# Altium project WeatherWidget.PrjPcb
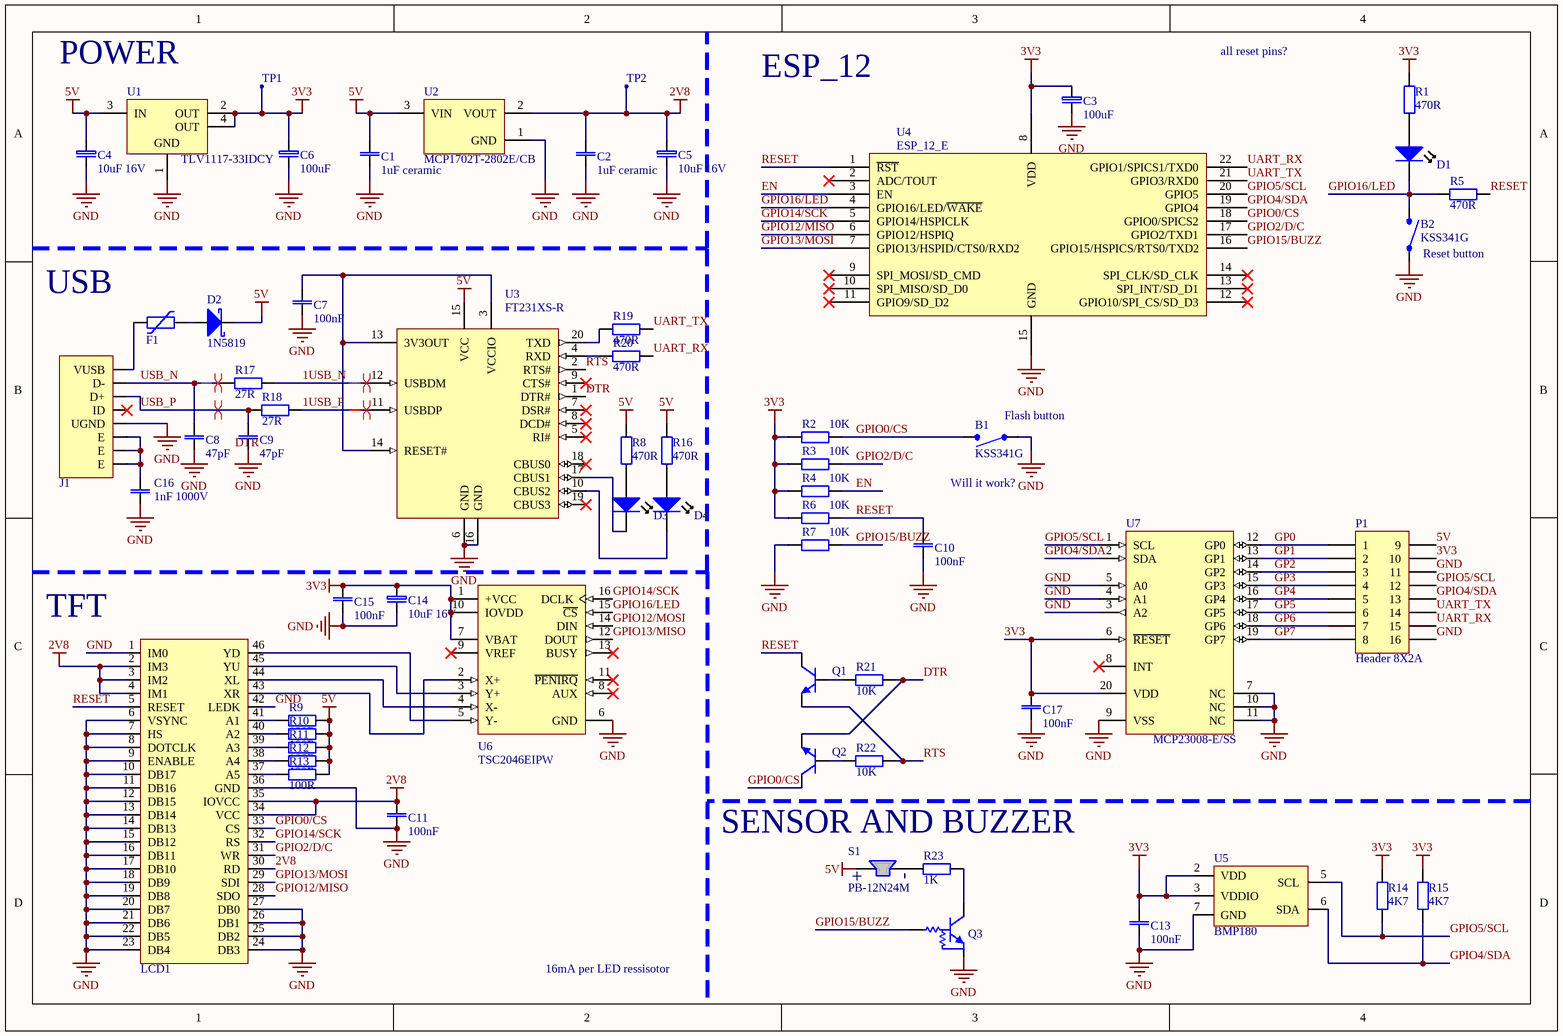
[diagram p0: WeatherStation_V2.SchDoc]
1 sheet, 62 parts. Net scope: global (net labels, ports and power ports of the same name join across sheets).
Board file: WeathcerStation_V2.PcbDoc

## Sheet WeatherStation_V2.SchDoc
size A4

### Parts
B1  KSS341G  [KSS341G]
B2  KSS341G  [KSS341G]
C1  1uF ceramic  [C0603]
C2  1uF ceramic  [C0603]
C3  100uF  [CASE B]
C4  10uF 16V  [Case A]
C5  10uF 16V  [Case A]
C6  100uF  [CASE B]
C7  100nF  [C0603]
C8  47pF  [C0603]
C9  47pF  [C0603]
C10  100nF  [C0603]
C11  100nF  [C0603]
C13  100nF  [C0603]
C14  10uF 16V  [Case A]
C15  100nF  [C0603]
C16  1nF 1000V  [C1206]
C17  100nF  [C0603]
D1  BLUE LED  [LED0805B]  (value not drawn)
D2  1N5819  [1N5819-SMA]
D3  GREEN LED  [LED0805G]  (value not drawn)
D4  GREEN LED  [LED0805G]  (value not drawn)
F1  MF-MSMF075-2  [F1812]  (value not drawn)
J1  USB B MICRO R/A SMD 1  [USB B MICRO R/A SMD 1]  (value not drawn)
LCD1  KWH032ST05-F02  [KWH032ST05-F02]  (value not drawn)
P1  Header 8X2A  [HDR2X8_CEN]
Q1  BC817  [SOT23]  (value not drawn)
Q2  BC817  [SOT23]  (value not drawn)
Q3  PDTC123JT  [SOT23]  (value not drawn)
R1  470R  [R0603]
R2  10K  [R0603]
R3  10K  [R0603]
R4  10K  [R0603]
R5  470R  [R0603]
R6  10K  [R0603]
R7  10K  [R0603]
R8  470R  [R0603]
R9  100R  [R0603]
R10  100R  [R0603]
R11  100R  [R0603]
R12  100R  [R0603]
R13  100R  [R0603]
R14  4K7  [R0603]
R15  4K7  [R0603]
R16  470R  [R0603]
R17  27R  [R0603]
R18  27R  [R0603]
R19  470R  [R0603]
R20  470R  [R0603]
R21  10K  [R0603]
R22  10K  [R0603]
R23  1K  [R0603]
S1  PB-12N24M  [PB-12N24M]
TP1  TestPoint_1.5mm  [TP_1.5mm]  (value not drawn)
TP2  TestPoint_1.5mm  [TP_1.5mm]  (value not drawn)
U1  TLV1117-33IDCY  [TI-DCY4_N]
U2  MCP1702T-2802E/CB  [SOT-23A-CB3_N]
U3  FT231XS-R  [SSOP-20_N]
U4  ESP_12_E  [ESP-12Q/F]
U5  BMP180  [BMP180]
U6  TSC2046EIPW  [PW016]
U7  MCP23008-E/SS  [SSOP-SS20_N]

### Nets
2V8: C2.2 C5.1 C11.2 LCD1.2(IM3) LCD1.3(IM2) LCD1.4(IM1) LCD1.30(RD) LCD1.34(VCC) LCD1.35(IOVCC) TP2.1 U2.2(VOUT)
3V3: C3.1 C6.1 C13.2 C14.1 C15.2 C17.2 P1.10 R1.1 R2.1 R3.1 R4.1 R6.1 R14.2 R15.2 TP1.1 U1.2(OUT) U1.4(OUT) U4.8(VDD) U5.2(VDD) U5.3(VDDIO) U6.1(+VCC) U6.7(VBAT) U6.10(IOVDD) U7.6(~{RESET}) U7.20(VDD)
5V: C1.2 C4.1 D2.1 P1.9 R8.2 R9.2 R10.2 R11.2 R12.2 R13.2 R16.2 S1.1(+) U1.3(IN) U2.3(VIN) U3.15(VCC)
GND: B1.1 B2.1 C1.1 C2.1 C3.2 C4.2 C5.2 C6.2 C7.1 C8.1 C9.1 C10.1 C11.1 C13.1 C14.2 C15.1 C16.1 C17.1 J1.5(UGND) LCD1.1(IM0) LCD1.6(VSYNC) LCD1.7(HS) LCD1.8(DOTCLK) LCD1.9(ENABLE) LCD1.10(DB17) LCD1.11(DB16) LCD1.12(DB15) LCD1.13(DB14) LCD1.14(DB13) LCD1.15(DB12) LCD1.16(DB11) LCD1.17(DB10) LCD1.18(DB9) LCD1.19(DB8) LCD1.20(DB7) LCD1.21(DB6) LCD1.22(DB5) LCD1.23(DB4) LCD1.24(DB3) LCD1.25(DB2) LCD1.26(DB1) LCD1.27(DB0) LCD1.36(GND) LCD1.42(LEDK) P1.11 P1.16 Q3.2 R7.1 U1.1(GND) U2.1(GND) U3.6(GND) U3.16(GND) U4.15(GND) U5.7(GND) U6.6(GND) U7.3(A2) U7.4(A1) U7.5(A0) U7.7(NC) U7.9(VSS) U7.10(NC) U7.11(NC)
1USB_N: R17.2 U3.12(USBDM)
1USB_P: R18.2 U3.11(USBDP)
DTR: Q2.2 R21.2 U3.1(DTR#)
EN: R4.2 U4.3(EN)
GP0: P1.1 U7.12(GP0)
GP1: P1.2 U7.13(GP1)
GP2: P1.3 U7.14(GP2)
GP3: P1.4 U7.15(GP3)
GP4: P1.5 U7.16(GP4)
GP5: P1.6 U7.17(GP5)
GP6: P1.7 U7.18(GP6)
GP7: P1.8 U7.19(GP7)
GPIO0/CS: B1.2 LCD1.33(CS) Q2.3 R2.2 U4.18(GPIO0/SPICS2)
GPIO2/D/C: LCD1.31(WR) R3.2 U4.17(GPIO2/TXD1)
GPIO4/SDA: P1.13 R15.1 U4.19(GPIO4) U5.6(SDA) U7.2(SDA)
GPIO5/SCL: P1.12 R14.1 U4.20(GPIO5) U5.5(SCL) U7.1(SCL)
GPIO12/MISO: LCD1.28(SDO) U4.6(GPIO12/HSPIQ)
GPIO12/MOSI: U6.14(DIN)
GPIO13/MISO: U6.12(DOUT)
GPIO13/MOSI: LCD1.29(SDI) U4.7(GPIO13/HSPID/CTS0/RXD2)
GPIO14/SCK: LCD1.32(RS) U4.5(GPIO14/HSPICLK) U6.16(DCLK)
GPIO15/BUZZ: Q3.1 R7.2 U4.16(GPIO15/HSPICS/RTS0/TXD2)
GPIO16/LED: B2.2 D1.1 R5.1 U4.4(GPIO16/LED/~{WAKE}) U6.15(~{CS})
RESET: C10.2 LCD1.5(RESET) Q1.3 R5.2 R6.2 U4.1(~{RST})
RTS: Q1.2 R22.2 U3.2(RTS#)
UART_RX: P1.15 R20.2 U4.22(GPIO1/SPICS1/TXD0)
UART_TX: P1.14 R19.2 U4.21(GPIO3/RXD0)
USB_N: C8.2 J1.2(D-) R17.1
USB_P: C9.2 J1.3(D+) R18.1
NetC7_2: C7.2 U3.3(VCCIO) U3.13(3V3OUT) U3.14(RESET#)
NetC16_2: C16.2 J1.6(E) J1.7(E) J1.8(E)
NetD1_2: D1.2 R1.2
NetD2_2: D2.2 F1.2
NetD3_1: D3.1 U3.17(CBUS1)
NetD3_2: D3.2 R8.1
NetD4_1: D4.1 U3.10(CBUS2)
NetD4_2: D4.2 R16.1
NetF1_1: F1.1 J1.1(VUSB)
NetLCD1_37: LCD1.37(A5) R13.1
NetLCD1_38: LCD1.38(A4) R12.1
NetLCD1_39: LCD1.39(A3) R11.1
NetLCD1_40: LCD1.40(A2) R10.1
NetLCD1_41: LCD1.41(A1) R9.1
NetLCD1_43: LCD1.43(XR) U6.2(X+)
NetLCD1_44: LCD1.44(XL) U6.4(X-)
NetLCD1_45: LCD1.45(YU) U6.3(Y+)
NetLCD1_46: LCD1.46(YD) U6.5(Y-)
NetQ1_1: Q1.1 R21.1
NetQ2_1: Q2.1 R22.1
NetQ3_3: Q3.3 R23.2
NetR19_1: R19.1 U3.20(TXD)
NetR20_1: R20.1 U3.4(RXD)
NetR23_1: R23.1 S1.2(-)

Not connected (* = marked no-connect by the designer): J1 4(ID)*; U3 5(RI#)* 7(DSR#)* 8(DCD#)* 9(CTS#)* 18(CBUS0)* 19(CBUS3)*; U4 2(ADC/TOUT)* 9(SPI_MOSI/SD_CMD)* 10(SPI_MISO/SD_D0)* 11(GPIO9/SD_D2)* 12(GPIO10/SPI_CS/SD_D3)* 13(SPI_INT/SD_D1)* 14(SPI_CLK/SD_CLK)*; U6 8(AUX)* 9(VREF)* 11(~{PENIRQ})* 13(BUSY)*; U7 8(INT)*

### Layout directives
differential pair: 1USB_N, 1USB_P, USB_N, USB_P

### Notes on the sheet
- (near U1) POWER
- ESP_12
- all reset pins?
- USB
- (near B2) Reset button
- (near B1) Flash button
- Will it work?
- (near LCD1) TFT
- SENSOR AND BUZZER
- 16mA per LED ressisotor
- Labels drawn without touching a wire or pin: DTR

### Library data of the parts
B1 B2 = KSS341G: side-mounted tactile button
C1 C2 C7-C11 C13 C15 C17 = C0603: SMD Capacitor
C3 C6 = Case B: Tantalum capacitor
C4 C5 C14 = Case A: Tantalum capacitor
C16 = C1206: SMD Capacitor
D1 = LED0805B: BLUE SMD LED 0805
D2 = 1N5819(SS14): 40V 1A UFM0.5V/1A IFM30A IR0.4mA, Schottky
D3 D4 = LED0805G: GREEN SMD LED 0805
F1 = PFMF.XXX.X: Resettable Fuse 1812
P1 = Header 8X2A: Header, 8-Pin, Dual row; LatestRevisionDate: 17-Jul-2002; LatestRevisionNote: Re-released for DXP Platform.; Publisher: Altium Limited
Q1 Q2 = BC817: NPN SOT23
Q3 = PDTC123JT: DIGI TRANS Rin 2.2k Rbe 47k NPN 50V 100mA
R1-R23 = R0603: SMD Resistor
TP1 TP2 = TestPoint_1.5mm: TestPoint SMD pad 1.5mm
U1 = TLV1117LV33DCYR: Single Output LDO, 1 A, Fixed 3.3 V Output, 2 to 5.5 V Input, 4-pin SOT-223 (DCY), -40 to 125 degC, Green (RoHS & no Sb/Br); Manufacturer: Texas Instruments; Accuracy(%): 2; Fixed Output Options(V): 3.3; Iout(Max)(A): 1; Iq(Typ)(mA): 0.05; SubFamily: Single Channel LDO; Vdo(Typ)(mV): 1200; Vin(Max)(V): 5.5; DatasheetVersion: SBVS160A; PackageVersion: 4202506/B; PackageReference: DCY4; PackageDescription: 4-Pin Plastic Small Outline, Body 3.5 x 6.5 mm, Pitch 2.3 mm; Supplier 1: Digi-Key; Supplier Part Number 1: 296-28778-2-ND; Supplier 2: Digi-Key; Supplier Part Number 2: 296-28778-1-ND; Supplier 3: Digi-Key; Supplier Part Number 3: 296-28778-6-ND; Supplier 4: Newark; Supplier Part Number 4: 48T4644; Supplier 5: Mouser; Supplier Part Number 5: 595-TLV1117LV33DCYR; Eco-Plan: Green (RoHS & no Sb/Br); Vin(Min)(V): 2; Vout Adj(Max)(V): 3.3; Vout Adj(Min)(V): 3.3; Mounting Technology: Surface Mount; Code_JEDEC: TO-261; PartNumber: TLV1117LV33DCYR; ComponentLink1Description: Manufacturer URL; ComponentLink1URL: http://www.ti.com/; ComponentLink2Description: Datasheet; ComponentLink2URL: http://www.ti.com/general/docs/lit/getliterature.tsp?genericPartNumber=TLV1117LV33&fileType=pdf; ComponentLink3Description: Package Specification; ComponentLink3URL: http://www.ti.com/litv/pdf/mpds094a
U2 = MCP1702T-2802E/CB: 250 mA Low Quiescent Current LDO Regulator, 3-Pin SOT-23A, Extended Temperature, Tape and Reel; Manufacturer: Microchip; DatasheetVersion: revD, Jun-2009; PackageVersion: revBB, Aug-2009; PackageReference: SOT-23A-CB3; PackageDescription: 3-Lead Plastic Small Outline Transistor (CB) [SOT-23A]; Supplier 1: Digi-Key; Supplier Part Number 1: MCP1702T-2802E/CBTR-ND; Supplier 2: Digi-Key; Supplier Part Number 2: MCP1702T-2802E/CBCT-ND; Supplier 3: Digi-Key; Supplier Part Number 3: MCP1702T-2802E/CBDKR-ND; Supplier 4: Mouser; Supplier Part Number 4: 579-MCP1702T2802E/CB; Mounting Technology: Surface Mount; PartNumber: MCP1702T-2802E/CB; ComponentLink1Description: Manufacturer URL; ComponentLink1URL: http://www.microchip.com/; ComponentLink2Description: Datasheet; ComponentLink2URL: http://ww1.microchip.com/downloads/en/DeviceDoc/22008d.pdf; ComponentLink3Description: Package Specification; ComponentLink3URL: http://www.microchip.com/stellent/groups/techpub_sg/documents/packagingspec/en012702.pdf
U3 = FT231XS-R: USB to Full-Handshake UART Interface Chip, UHCI/OHCI/EHCI Compatible, USB 2.0 Compatible, -40 to +85 degC, 20-Pin SSOP, Pb-Free, Tape and Reel; Manufacturer: FTDI; DatasheetVersion: ver 1.2, Feb-2013; PackageVersion: Feb-13; PackageReference: SSOP-20; PackageDescription: 20-Pin Small Outline Package, 8.6 x 3.9 mm Body, 0.635 mm Pitch; Code_JEDEC: MO-137-AD; PartNumber: FT231XS-R; ComponentLink1Description: Manufacturer URL; ComponentLink1URL: http://www.ftdichip.com/; ComponentLink2Description: Datasheet; ComponentLink2URL: http://www.ftdichip.com/Support/Documents/DataSheets/ICs/DS_FT231X.pdf; ComponentLink3Description: FT231X Product Page; ComponentLink3URL: www.ftdichip.com/Products/ICs/FT231X.html
U4 = ESP_12_E: ESP-12 Wi-Fi Module by AI-Thinker; IC: ESP8266-EX; Vendor: Ai-thinker
U5 = BMP180: temperature/pressure/altitude sensor
U6 = TSC2046EIPW: 4-Wire Touch Screen controller with Low-Voltage I/O Interface, 16-Pin TSSOP; Published: 6-Oct-2005; DatasheetVersion: Jan-2005; PackageVersion: Feb-1999; PackageReference: PW016; Publisher: Altium Limited; PackageDescription: Shrink Small Outline; 16 Leads; Body Width 4.4 mm; Pitch 0.65 mm; ComponentLink1Description: Manufacturer Link; ComponentLink1URL: http://focus.ti.com/docs/prod/folders/print/tsc2046.html; ComponentLink2Description: Datasheet; ComponentLink2URL: http://focus.ti.com/lit/ds/symlink/tcs2046.pdf
U7 = MCP23008-E/SS: 8-Bit I/O Expander with Serial Interface, 20-Pin SSOP, Extended Temperature; Manufacturer: Microchip; DatasheetVersion: revE, Aug-2007; PackageVersion: revBB, Aug-2009; PackageReference: SSOP-SS20; PackageDescription: 20-Lead Plastic Shrink Small Outline (SS) - 5.3mm Body [SSOP]; Supplier 1: Digi-Key; Supplier Part Number 1: MCP23008-E/SS-ND; Supplier 2: Farnell; Supplier Part Number 2: 1605564; Supplier 3: Newark; Supplier Part Number 3: 08J8739; Supplier 4: Mouser; Supplier Part Number 4: 579-MCP23008-E/SS; Mounting Technology: Surface Mount; Code_JEDEC: MO-150; PartNumber: MCP23008-E/SS; ComponentLink1Description: Manufacturer URL; ComponentLink1URL: http://www.microchip.com/; ComponentLink2Description: Datasheet; ComponentLink2URL: http://ww1.microchip.com/downloads/en/DeviceDoc/21919e.pdf; ComponentLink3Description: Package Specification; ComponentLink3URL: http://www.microchip.com/stellent/groups/techpub_sg/documents/packagingspec/en012702.pdf